# Altium schematic sheet Main.SchDoc
size A4; SheetNumber: 1; SheetTotal: 7; ENG_APP_DATE: --/--/--; DSN_APP_DATE: --/--/--; CHK_APP_DATE: --/--/--
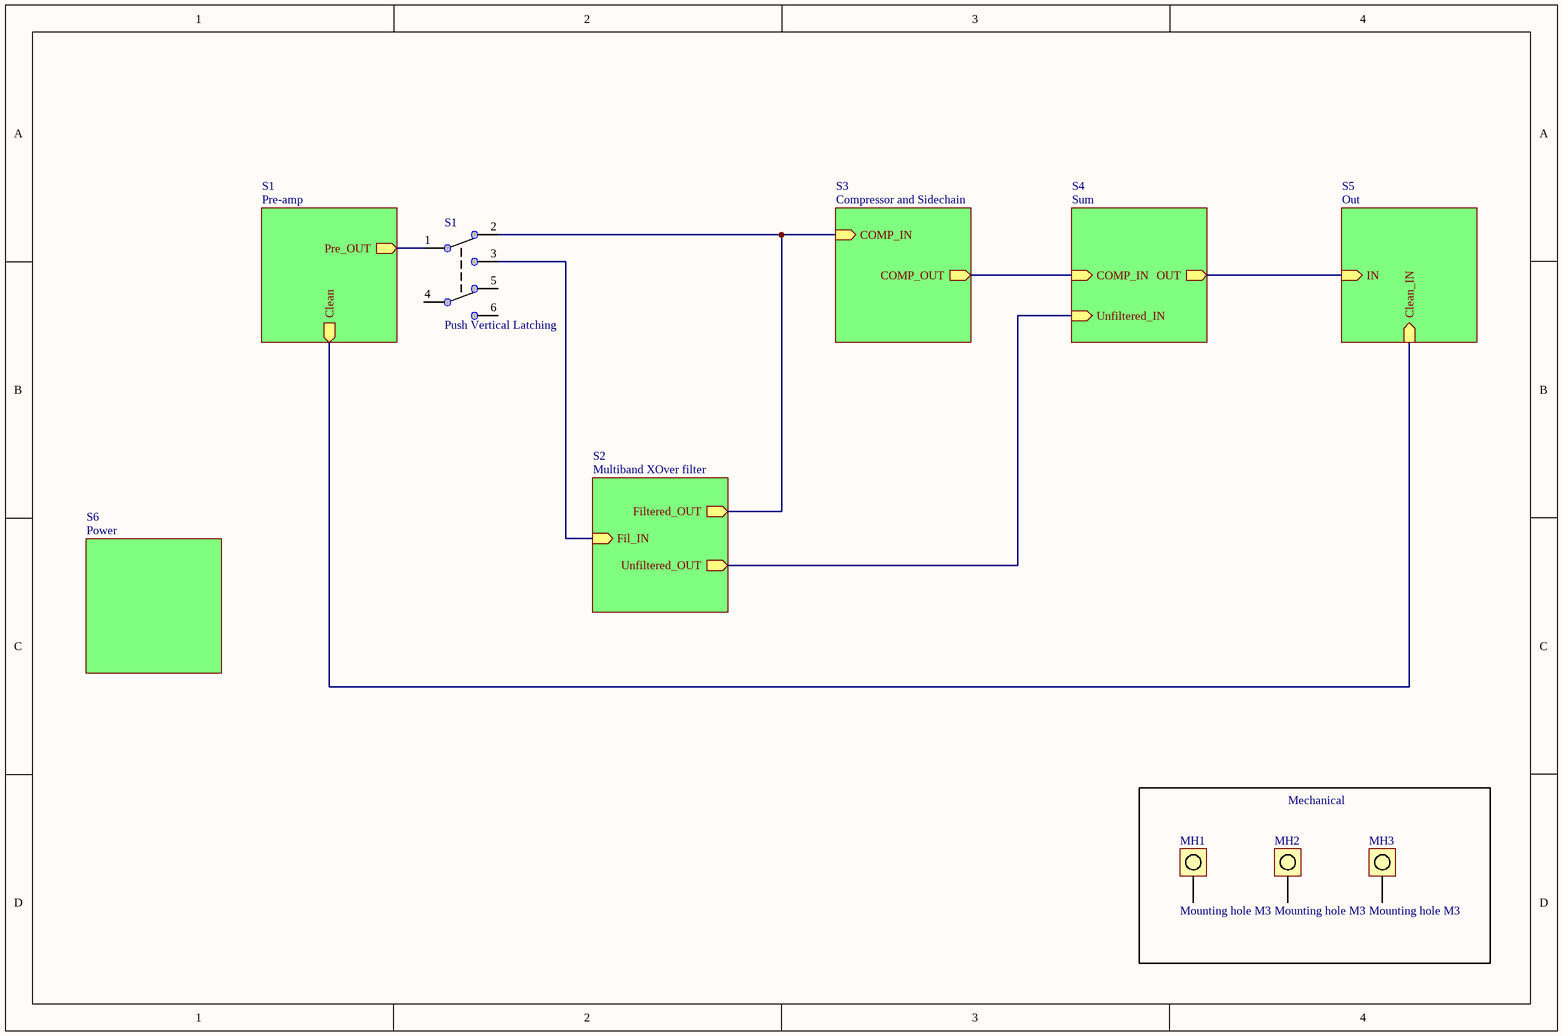
[diagram p0: Main.SchDoc]

## Parts
MH1  Mounting hole M3  [Mounting hole M3]  (no BOM)
MH2  Mounting hole M3  [Mounting hole M3]  (no BOM)
MH3  Mounting hole M3  [Mounting hole M3]  (no BOM)
S1  Push Vertical Latching  [PUSH VERTICAL DPDT]

## Blocks framed on the sheet
Mechanical: MH1-MH3

## Sub-sheets
S1 = Pre-amp: Pre_OUT (out), Clean (out)
S2 = Multiband XOver filter: Fil_IN (in), Filtered_OUT (out), Unfiltered_OUT (out)
S3 = Compressor and Sidechain: COMP_IN (in), COMP_OUT (out)
S4 = Sum: Unfiltered_IN (in), COMP_IN (in), OUT (out)
S5 = Out: IN (in), Clean_IN (in)
S6 = Power: no entries

## Nets
NetS1_1: S1.1 ; sheet S1/Pre_OUT
NetS1_2: S1.2 ; sheet S3/COMP_IN, sheet S2/Filtered_OUT
NetS1_3: S1.3 ; sheet S2/Fil_IN
(unnamed): sheet S1/Clean, sheet S5/Clean_IN
(unnamed): sheet S3/COMP_OUT, sheet S4/COMP_IN
(unnamed): sheet S5/IN, sheet S4/OUT
(unnamed): sheet S2/Unfiltered_OUT, sheet S4/Unfiltered_IN

Not connected (* = marked no-connect by the designer): MH1 1; MH2 1; MH3 1; S1 4 5 6

## Notes on the sheet
- Document:
- Size:
- Modified date:
- A4
- Number:
- Revision:
- Sheet
- of
- Project:

## Library data of the parts
MH1-MH3 = CMP-021-0014-4: 3.2 mm mounting hole for M3 screw; Design Item ID: Mounting hole M3; Source: jimi.SchLib
S1 = CMP-028-0063-7: DPDT Pushbutton Latching; Manufacturer Part Number: TL2201EEXA; Darkglass part: D00-0005; Manufacturer: E-Switch; Electrical Life: 10000Cycles; Voltage Rating (DC): 30V; Supplied by Darkglass: YES; Actuator Length: 3mm; Operating Force: 2.16N; Current Rating: 100mA; Switch Function: On-On; ComponentLink2URL: https://datasheet.ciiva.com/16156/p010350f-16156301.pdf?src-supplier=Onlinecomponents.com; Termination: PC Pin; Design Item ID: Push Vertical; Source: main.SchLib; Max Voltage Rating (DC): 30V; RoHS: Yes; Orientation: Straight; Stock 1: 351; ComponentLink1URL: https://datasheet.ciiva.com/2879/p010350g-2879559.pdf?src-supplier=Digi-Key; Throw Configuration: DPDT; Lead Free: Lead Free; ComponentLink1Description: https://datasheet.ciiva.com/2879/p010350g-2879559.pdf?src-supplier=Digi-Key; Package Quantity: 700; ComponentLink2Description: https://datasheet.ciiva.com/16156/p010350f-16156301.pdf?src-supplier=Onlinecomponents.com; Contact Material: Silver; Selective Soldering: YES; Packaging: Bulk; Mount: Through Hole; Pricing 1: 1=0,70000, 10=0,66300, 25=0,63400, 50=0,60400, 100=0,58900, 250=0,57400, 500=0,54500, 1000=0,51500, 2500=0,49200, 10000=0,49200 (USD)